# Altium schematic sheet USB_Isolation.SchDoc
size A4; SheetNumber: 7; SheetTotal: 8
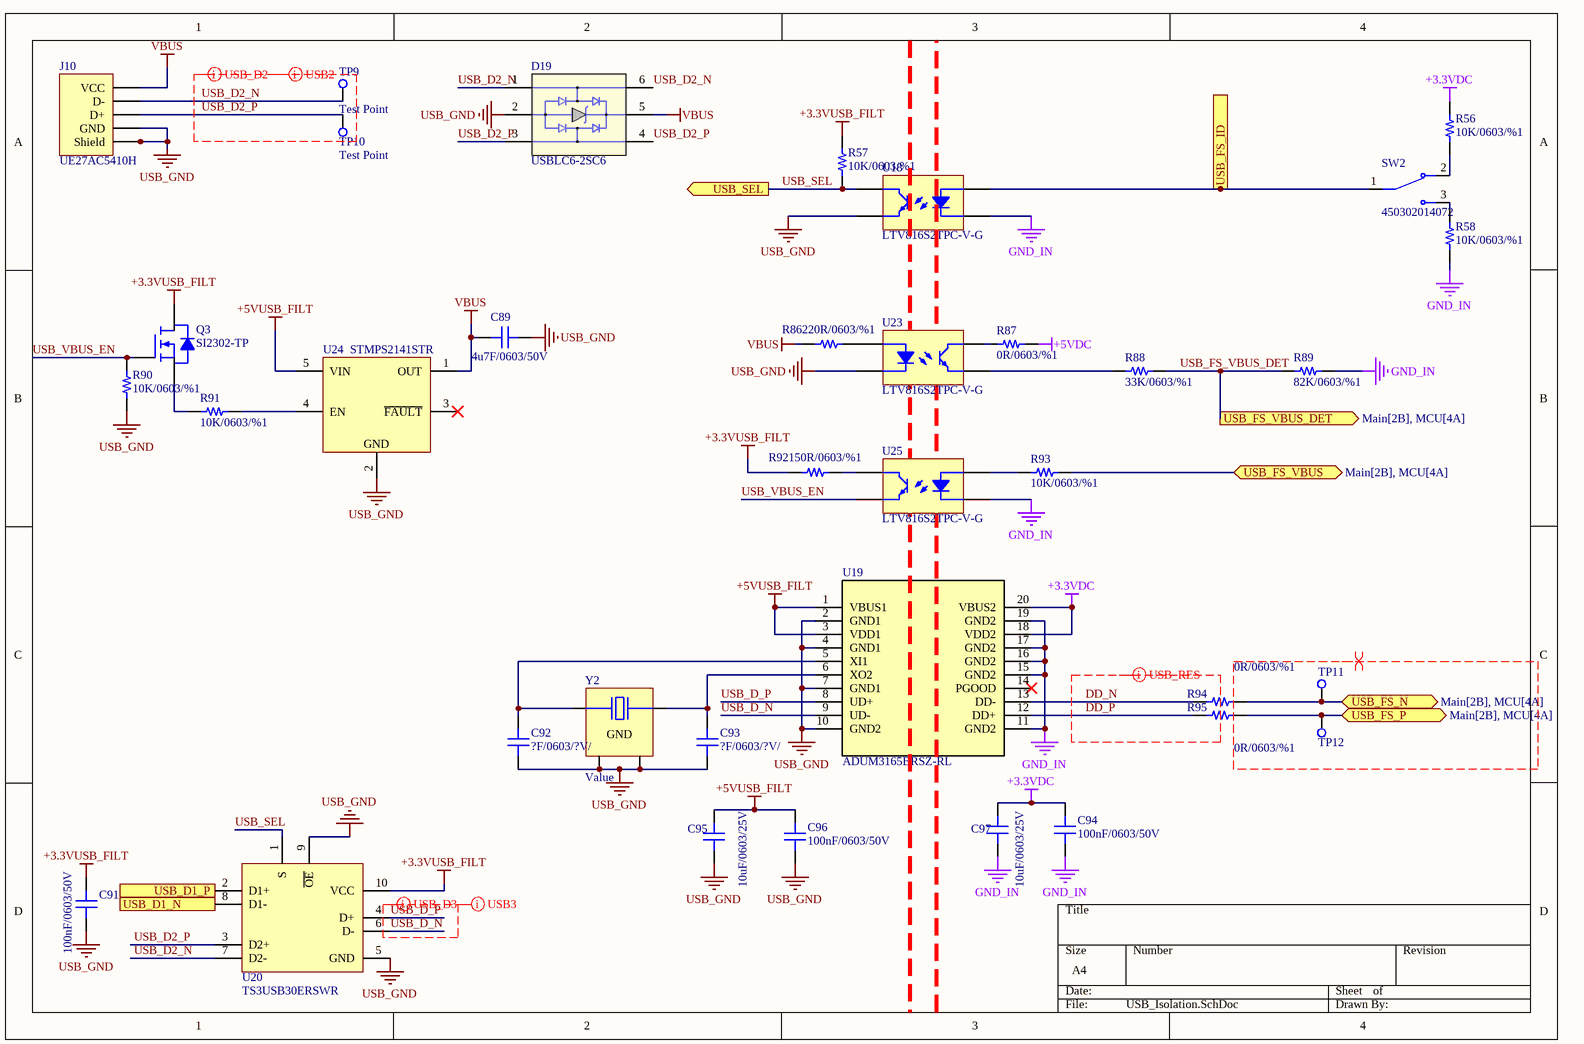
[diagram p0: USB_Isolation.SchDoc]

## Parts
C89  4u7F/0603/50V  [0603_cap]
C91  100nF/0603/50V  [0603_cap]
C92  ?F/0603/?V/  [0603_cap]
C93  ?F/0603/?V/  [0603_cap]
C94  100nF/0603/50V  [0603_cap]
C95  10uF/0603/25V  [0603_cap]
C96  100nF/0603/50V  [0603_cap]
C97  10uF/0603/25V  [0603_cap]
D19  USBLC6-2SC6  [TI SOT-23-6 DBV]
J10  UE27AC5410H  [UE27AC5410H]
Q3  SI2302-TP  [TI SOT-23-3 DBZ]
R56  10K/0603/%1  [0603_res]
R57  10K/0603/%1  [0603_res]
R58  10K/0603/%1  [0603_res]
R86  220R/0603/%1  [0603_res]
R87  0R/0603/%1  [0603_res]
R88  33K/0603/%1  [0603_res]
R89  82K/0603/%1  [0603_res]
R90  10K/0603/%1  [0603_res]
R91  10K/0603/%1  [0603_res]
R92  150R/0603/%1  [0603_res]
R93  10K/0603/%1  [0603_res]
R94  0R/0603/%1  [0603_res]
R95  0R/0603/%1  [0603_res]
SW2  450302014072  [450302014072]
TP9  Test Point  [tp]
TP10  Test Point  [tp]
TP11  Test Point  [tp]  (value not drawn)
TP12  Test Point  [tp]  (value not drawn)
U18  LTV816S2TPC-V-G  [4-SMD, Gull Wing]
U19  ADUM3165BRSZ-RL  [SSOP-20]
U20  TS3USB30ERSWR  [VSSOP-10]
U23  LTV816S2TPC-V-G  [4-SMD, Gull Wing]
U24  STMPS2141STR  [SOT-23-5]
U25  LTV816S2TPC-V-G  [4-SMD, Gull Wing]
Y2  Value  [SMD4-Nolead]

## Ports
USB_D1_N (in, see Main[2B], System_Power[3D]), USB_D1_P (in, see Main[2B], System_Power[3D]), USB_FS_ID (out, see Main[2B], MCU[4A]), USB_FS_N (bidir, see Main[2B], MCU[4A]), USB_FS_P (bidir, see Main[2B], MCU[4A]), USB_FS_VBUS (bidir, see Main[2B], MCU[4A]), USB_FS_VBUS_DET (out, see Main[2B], MCU[4A]), USB_SEL (out, see Main[2B])

## Nets
+3.3VDC: C94.2 C97.2 R56.1 U19.18(VDD2) U19.20(VBUS2)
+3.3VUSB_FILT: C91.1 Q3.3(D) R57.1 R92.1 U20.10(VCC)
+5VDC: R87.1
+5VUSB_FILT: C95.2 C96.2 U19.1(VBUS1) U19.3(VDD1) U24.5(VIN)
GND_IN: C94.1 C97.1 R58.2 R89.2 U18.2 U19.11(GND2) U19.15(GND2) U19.16(GND2) U19.17(GND2) U19.19(GND2) U25.2
USB_GND: C89.2 C91.2 C92.1 C93.1 C95.1 C96.1 D19.2 J10.04(GND) J10.S1(Shield) J10.S2(Shield) R90.1 U18.3 U19.2(GND1) U19.4(GND1) U19.7(GND1) U19.10(GND2) U20.5(GND) U20.9(~{OE}) U23.2 U24.2(GND) Y2.2(GND) Y2.4(GND)
VBUS: C89.1 D19.5 J10.01(VCC) R86.1 U24.1(OUT)
DD_N: R94.2 U19.13(DD-)
DD_P: R95.2 U19.12(DD+)
USB_D1_N: U20.8(D1-) ; port USB_D1_N
USB_D1_P: U20.2(D1+) ; port USB_D1_P
USB_D2_N: D19.1 D19.6 J10.02(D-) TP9.1(TP) U20.7(D2-)
USB_D2_P: D19.3 D19.4 J10.03(D+) TP10.1(TP) U20.3(D2+)
USB_D_N: U19.9(UD-) U20.6(D-)
USB_D_P: U19.8(UD+) U20.4(D+)
USB_FS_ID: SW2.1 U18.1 ; port USB_FS_ID
USB_FS_N: R94.1 TP11.1(TP) ; port USB_FS_N
USB_FS_P: R95.1 TP12.1(TP) ; port USB_FS_P
USB_FS_VBUS: R93.1 ; port USB_FS_VBUS
USB_FS_VBUS_DET: R88.2 R89.1 ; port USB_FS_VBUS_DET
USB_SEL: R57.2 U18.4 U20.1(S) ; port USB_SEL
USB_VBUS_EN: Q3.1(G) R90.2 U25.3
NetC92_2: C92.2 U19.5(XI1) Y2.1
NetC93_2: C93.2 U19.6(XO2) Y2.3
NetQ3_2: Q3.2(S) R91.1
NetR56_2: R56.2 SW2.2
NetR58_1: R58.1 SW2.3
NetR86_2: R86.2 U23.1
NetR87_2: R87.2 U23.4
NetR88_1: R88.1 U23.3
NetR91_2: R91.2 U24.4(EN)
NetR92_2: R92.2 U25.4
NetR93_2: R93.2 U25.1

Not connected (* = marked no-connect by the designer): U19 14(PGOOD)*; U24 3(~{FAULT})*

## Layout directives
differential pair: (no net found under the mark), DD_N, DD_P, USB_D2_N, USB_D2_P, USB_D_N, USB_D_P
mark named USB2: USB_D2_N, USB_D2_P
mark named USB3: USB_D_N, USB_D_P

## Library data of the parts
C89 C91-C97 = Capacitor: HelpURL: *; PN: *; Assembly: *
  C89: Value: 4u7F/0603/50V
  C91 C94 C96: Value: 100nF/0603/50V
  C92 C93: Value: ?F/0603/?V/
  C95 C97: Value: 10uF/0603/25V
D19 = USBLC6-2SC6: 17V Clamp 5A (8/20µs) Ipp Tvs Diode Surface Mount SOT-23-6; Assembly: .; Value: USBLC6-2SC6; PN: USBLC6-2SC6; HelpURL: https://www.digikey.com/en/products/detail/stmicroelectronics/USBLC6-2SC6/1040559
J10 = USB 2.0 TYPE A: Assembly: .; Value: UE27AC5410H; PN: UE27AC5410H; HelpURL: https://www.ozdisan.com/p/usb-konnektorler-357/amphenol-ue27ac5410h-625506
Q3 = N-CHN MOS SOT: MOSFET N-CH 20V 3A SOT-23; Assembly: .; Help URL: https://www.digikey.com/en/products/detail/mcc-micro-commercial-components/SI2302-TP/1793243; PN: SI2302-TP; Value: SI2302-TP
R56-R58 R86-R95 = RES: Assembly: .; HelpURL: *; PN: *
  R56-R58 R90 R91 R93: Value: 10K/0603/%1
  R86: Value: 220R/0603/%1
  R87 R94 R95: Value: 0R/0603/%1
  R88: Value: 33K/0603/%1
  R89: Value: 82K/0603/%1
  R92: Value: 150R/0603/%1
SW2 = SPDT: Assembly: .; Value: 450302014072; PN: 450302014072; HelpURl: https://www.digikey.com/en/products/detail/w%C3%BCrth-elektronik/450302014072/5209105
U18 U23 U25 = OPTO: Assembly: .; Value: LTV816S2TPC-V-G; PN: LTV816S2TPC-V-G; HelpURL: https://www.ozdisan.com/p/transistor-ve-fotovoltaik-cikisli-optokuplorler-189/liteon-ltv816s2tpc-v-g-951812
U19 = ADUM3165: 3.75 kV RMS Digital Isolators for Isolated USB 2.0 High, Full, and Low Speed; Assembly: .; Value: ADUM3165BRSZ-RL; PN: ADUM3165BRSZ-RL; HelpURL: https://www.digikey.com/en/products/detail/analog-devices-inc/ADUM3165BRSZ-RL/16580710
U20 = TS3USB30ERSWR: Assembly: .; PN: TS3USB30ERSWR; Value: TS3USB30ERSWR; helpURL: https://www.digikey.com/en/products/detail/texas-instruments/TS3USB30ERSWR/2092506
U24 = STMPS2141STR: IC PWR SWITCH N-CHAN 1:1 SOT23-5; Manufacturer: STMicroelectronics; Assembly: .; Help URL: https://www.ozdisan.com/p/power-switch-entegreleri-283/stm-stmps2141str-481741; PN: STMPS2141STR; Value: STMPS2141STR
Y2 = Crystal(4-SMD): 25 MHz ±10ppm Crystal 10pF 50 Ohms 4-SMD, No Lead; Value: ABM8-25.000MHZ-10-D1G-T; Assembly: .; PN: ABM8-25.000MHZ-10-D1G-T; HelpURL: https://www.digikey.com/en/products/detail/abracon-llc/ABM8-25-000MHZ-10-D1G-T/5980064?s=N4IgTCBcDaIIICECyAOAtGArAOgAz6QAkAtNARlzQBEyBxNAFRAF0BfIA